# Altium schematic sheet Sheet1.SchDoc
size A4
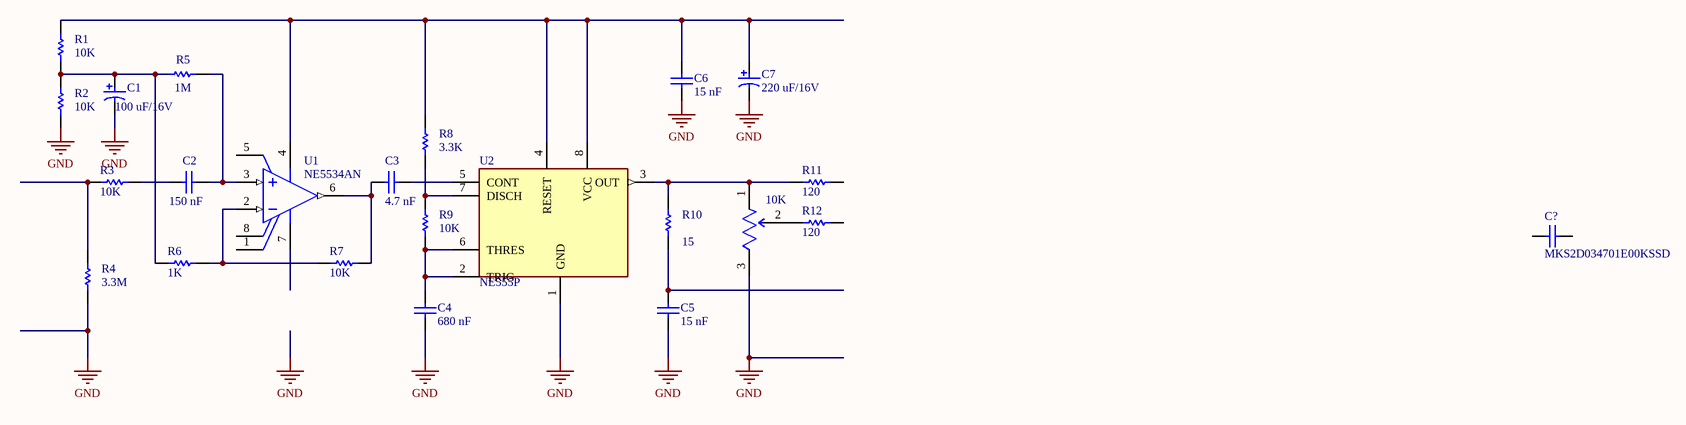
[diagram p0: Sheet1.SchDoc]

## Parts
10K  3296W-1-103RLF  [FP-3296W-MFG]  (value not drawn)
C1  100 uF/16V  [PNSC-ECA-1VM221-2]
C2  150 nF  [WIMA-MKS2D034701E00]
C3  4.7 nF  [WIMA-MKS2D034701E00]
C4  680 nF  [WIMA-MKS2D034701E00]
C5  15 nF  [WIMA-MKS2D034701E00]
C6  15 nF  [WIMA-MKS2D034701E00]
C7  220 uF/16V  [PNSC-ECA-1VM221-2]
C?  MKS2D034701E00KSSD  [WIMA-MKS2D034701E00]
R1  10K  [RESA60-630X240]
R2  10K  [RESA60-630X240]
R3  10K  [RESA60-630X240]
R4  3.3M  [RESA60-630X240]
R5  1M  [RESA60-630X240]
R6  1K  [RESA60-630X240]
R7  10K  [RESA60-630X240]
R8  3.3K  [RESA60-630X240]
R9  10K  [RESA60-630X240]
R10  15  [RESA60-630X240]
R11  120  [RESA60-630X240]
R12  120  [RESA60-630X240]
U1  NE5534AN  [ONSC-PDIP-8-626-05_M]
U2  NE555P  [FP-D0008A-MFG]

## Nets
GND: 10K.3(CW) C1.2 C4.1 C5.1 C6.1 C7.2 R2.1 R4.1 U2.1(GND)
Net10K_1: 10K.1(CCW) R10.2 R11.1 U2.3(OUT)
Net10K_2: 10K.2(WIPER) R12.1
NetC1_1: C1.1 R1.1 R2.2 R5.1 R6.1
NetC2_1: C2.1 R3.2
NetC2_2: C2.2 R5.2 U1.3(IN+)
NetC3_1: C3.1 R7.2 U1.6(OUT)
NetC3_2: C3.2 U2.5(CONT)
NetC4_2: C4.2 R9.1 U2.2(TRIG) U2.6(THRES)
NetC5_2: C5.2 R10.1
NetC6_2: C6.2 C7.1 R1.2 R8.2 U1.4(V-) U2.4(RESET) U2.8(VCC)
NetR3_1: R3.1 R4.2
NetR6_2: R6.2 R7.1 U1.2(IN-)
NetR8_1: R8.1 R9.2 U2.7(DISCH)

Not connected (* = marked no-connect by the designer): C? 1 2; R11 2; R12 2; U1 1(BALANCE) 5(COMPENSATION) 7(V+) 8(BALANCE/COMPENSATION)

## Library data of the parts
10K = CMP-07234-000024-1: TRIMMER 10K OHM 0.5W PC PIN TOP; Resistance: 10kR; Temperature Coefficient: 100ppm/°C; Power Rating: 500mW; Tolerance: 10%; Number of Turns: 25; Width: 0.19inch; Termination: Pin; Radiation Hardening: No; Contact Plating: Tin; Composition: Cermet; Length: 9.53mm; Height: 0.395inch; Depth: 4.83mm; REACH SVHC: No SVHC; Weight: 0.03oz; Min Operating Temperature: -55°C; Military Standard: Not; Max Operating Temperature: 125°C; Packaging: Tape and Reel; Package Quantity: 1; Taper: Linear; Max Power Dissipation: 500mW; Mount: Through Hole
C1 = CMP-2000-05311-1: Aluminum Electrolytic Capacitor, 100 uF, +/- 20%, 16 V, -40 to 85 degC, 2-Pin THD, RoHS, Bulk; Manufacturer: Panasonic; Lifetime@Temperature: 2000Hrs@85degC; Rated Voltage: 35V; Ripple Current: 350mA; Type: Radial; Capacitance: 220µF; Package Reference: ECA-1VM221; Series: M; Operating Temp Range: -40to+85degC; Package Description: 2-Pin Axial Lead, Dia 8 mm, Body Length 12.5 mm; Datasheet Version: Mar-06; Datasheet URL: https://datasheet.ciiva.com/26341/441851-da-01-en-elko-eca1vm221-m-r-220myf-35v-85c-26341906.pdf; Operating Temp-Max: 85degC; Case Size/Dimension: Ø8x11.5mm; Manufacturer URL: http://www.panasonic.com/
C2 = CMP-2000-06717-1: Metallized Polyester (PET) Capacitor, 150 nF, +/- 10%, 310 V AC, -55 to 100 degC, 2-Pin THD, RoHS, Bulk; Manufacturer: Wima; SVHC: NoSVHC(15-Jun-2015); Capacitor Dielectric Type: PET(Polyester); Voltage Rating: 100V; Capacitance: 0.47µF; Capacitor Terminals: RadialLeaded; Product Range: MKS2Series; Package Description: 2-Pin Through Hole Device, Body 7.2 x 4.5 mm, Pitch 5 mm; Mounting Technology: ThroughHole; Package Reference: MKS2D034701E00; Packaging: Each; Automotive Qualification Standard: -; Datasheet Version: 04/2016; Manufacturer URL: http://www.wima.com/; Operating Temperature Max: 100°C; Datasheet URL: http://www.wima.com/EN/WIMA_MKS_2.pdf; Operating Temperature Min: -55°C; Capacitance Tolerance: ±10%; Lead Spacing: 5mm; Capacitor Case Style: -
C3 = CMP-2000-06717-1: Metallized Polyester (PET) Capacitor, 4.7 nF, +/- 10%, 310 V AC, -55 to 100 degC, 2-Pin THD, RoHS, Bulk; Manufacturer: Wima; SVHC: NoSVHC(15-Jun-2015); Capacitor Dielectric Type: PET(Polyester); Voltage Rating: 100V; Capacitance: 0.47µF; Capacitor Terminals: RadialLeaded; Product Range: MKS2Series; Package Description: 2-Pin Through Hole Device, Body 7.2 x 4.5 mm, Pitch 5 mm; Mounting Technology: ThroughHole; Package Reference: MKS2D034701E00; Packaging: Each; Automotive Qualification Standard: -; Datasheet Version: 04/2016; Manufacturer URL: http://www.wima.com/; Operating Temperature Max: 100°C; Datasheet URL: http://www.wima.com/EN/WIMA_MKS_2.pdf; Operating Temperature Min: -55°C; Capacitance Tolerance: ±10%; Lead Spacing: 5mm; Capacitor Case Style: -
C4 = CMP-2000-06717-1: Metallized Polyester (PET) Capacitor, 680 nF, +/- 10%, 250V DC, -55 to 100 degC, 2-Pin THD, RoHS, Bulk; Manufacturer: Wima; SVHC: NoSVHC(15-Jun-2015); Capacitor Dielectric Type: PET(Polyester); Voltage Rating: 100V; Capacitance: 0.47µF; Capacitor Terminals: RadialLeaded; Product Range: MKS2Series; Package Description: 2-Pin Through Hole Device, Body 7.2 x 4.5 mm, Pitch 5 mm; Mounting Technology: ThroughHole; Package Reference: MKS2D034701E00; Packaging: Each; Automotive Qualification Standard: -; Datasheet Version: 04/2016; Manufacturer URL: http://www.wima.com/; Operating Temperature Max: 100°C; Datasheet URL: http://www.wima.com/EN/WIMA_MKS_2.pdf; Operating Temperature Min: -55°C; Capacitance Tolerance: ±10%; Lead Spacing: 5mm; Capacitor Case Style: -
C5 C6 = CMP-2000-06717-1: Metallized Polyester (PET) Capacitor, 15 nF, +/- 10%, 275 V AC, -55 to 100 degC, 2-Pin THD, RoHS, Bulk; Manufacturer: Wima; SVHC: NoSVHC(15-Jun-2015); Capacitor Dielectric Type: PET(Polyester); Voltage Rating: 100V; Capacitance: 0.47µF; Capacitor Terminals: RadialLeaded; Product Range: MKS2Series; Package Description: 2-Pin Through Hole Device, Body 7.2 x 4.5 mm, Pitch 5 mm; Mounting Technology: ThroughHole; Package Reference: MKS2D034701E00; Packaging: Each; Automotive Qualification Standard: -; Datasheet Version: 04/2016; Manufacturer URL: http://www.wima.com/; Operating Temperature Max: 100°C; Datasheet URL: http://www.wima.com/EN/WIMA_MKS_2.pdf; Operating Temperature Min: -55°C; Capacitance Tolerance: ±10%; Lead Spacing: 5mm; Capacitor Case Style: -
C7 = CMP-2000-05311-1: Aluminum Electrolytic Capacitor, 220 uF, +/- 20%, 16 V, -40 to 85 degC, 2-Pin THD, RoHS, Bulk; Manufacturer: Panasonic; Lifetime@Temperature: 2000Hrs@85degC; Rated Voltage: 35V; Ripple Current: 350mA; Type: Radial; Capacitance: 220µF; Package Reference: ECA-1VM221; Series: M; Operating Temp Range: -40to+85degC; Package Description: 2-Pin Axial Lead, Dia 8 mm, Body Length 12.5 mm; Datasheet Version: Mar-06; Datasheet URL: https://datasheet.ciiva.com/26341/441851-da-01-en-elko-eca1vm221-m-r-220myf-35v-85c-26341906.pdf; Operating Temp-Max: 85degC; Case Size/Dimension: Ø8x11.5mm; Manufacturer URL: http://www.panasonic.com/
C? = CMP-2000-06717-1: Metallized Polyester (PET) Capacitor, 0.47 uF, +/- 10%, 100 V DC, 63 V AC, -55 to 100 degC, 2-Pin THD, RoHS, Bulk; Manufacturer: Wima; SVHC: NoSVHC(15-Jun-2015); Capacitor Dielectric Type: PET(Polyester); Voltage Rating: 100V; Capacitance: 0.47µF; Capacitor Terminals: RadialLeaded; Product Range: MKS2Series; Package Description: 2-Pin Through Hole Device, Body 7.2 x 4.5 mm, Pitch 5 mm; Mounting Technology: ThroughHole; Package Reference: MKS2D034701E00; Packaging: Each; Automotive Qualification Standard: -; Datasheet Version: 04/2016; Manufacturer URL: http://www.wima.com/; Operating Temperature Max: 100°C; Datasheet URL: http://www.wima.com/EN/WIMA_MKS_2.pdf; Operating Temperature Min: -55°C; Capacitance Tolerance: ±10%; Lead Spacing: 5mm; Capacitor Case Style: -
R1 R2 R7 R9 = CMP-1659-00074-2: Axial Resistor, 10 KOhm, +/- 1%, 0.25 W, -55 to 155 degC, 2-Pin THD, RoHS, Bulk; Manufacturer: Yageo; Temperature Coefficient: 100ppm\/degreesC; Voltage Rating: 250V; Voltage Rating (DC): 200V; Resistance: 10KOhm; Max Power Dissipation: 250mW; Datasheet URL: http://www.yageo.com/documents/recent/Yageo%20LR_MFR_2013.pdf; Packaging: Bulk; RoHSCompliant: True; Mount: ThroughHole; Package Reference: MFR-25; Termination: Axial; Composition: MetalFilm; Number of Terminations: 2; Package Quantity: 200; Mounting Technology: ThroughHole; Length: 0.248inch; Max Operating Temperature: 155degC; Min Operating Temperature: -55degC; Datasheet Version: 04/2013; Lead Free: LeadFree; Manufacturer URL: http://www.yageo.com/; Tolerance: 1%; Power Rating: 250mW; Package Description: 2-Pin Axial Lead, Dia 2.4 mm, Body Length 6.3 mm; Military Standard: Not; Case\/Package: Axial
R3 = CMP-1659-00074-2: Axial Resistor, 10KOhm, +/- 5%, 0.25 W, -55 to 155 degC, 2-Pin THD, RoHS, Bulk; Manufacturer: Yageo; Temperature Coefficient: 100ppm\/degreesC; Voltage Rating: 250V; Voltage Rating (DC): 200V; Max Power Dissipation: 250mW; Tolerance: 1%; Datasheet URL: http://www.yageo.com/documents/recent/Yageo%20LR_MFR_2013.pdf; Packaging: Bulk; RoHSCompliant: True; Mount: ThroughHole; Package Reference: MFR-25; Termination: Axial; Composition: MetalFilm; Number of Terminations: 2; Resistance: 10KOhm; Package Quantity: 200; Mounting Technology: ThroughHole; Length: 0.248inch; Max Operating Temperature: 155degC; Min Operating Temperature: -55degC; Datasheet Version: 04/2013; Lead Free: LeadFree; Manufacturer URL: http://www.yageo.com/; Power Rating: 250mW; Package Description: 2-Pin Axial Lead, Dia 2.4 mm, Body Length 6.3 mm; Military Standard: Not; Case\/Package: Axial
R4 = CMP-1659-00074-2: Axial Resistor, 3.3 MOhm, +/- 5%, 0.25 W, -55 to 155 degC, 2-Pin THD, RoHS, Bulk; Manufacturer: Yageo; Temperature Coefficient: 100ppm\/degreesC; Voltage Rating: 250V; Voltage Rating (DC): 200V; Resistance: 10KOhm; Max Power Dissipation: 250mW; Tolerance: 1%; Datasheet URL: http://www.yageo.com/documents/recent/Yageo%20LR_MFR_2013.pdf; Packaging: Bulk; RoHSCompliant: True; Mount: ThroughHole; Package Reference: MFR-25; Termination: Axial; Composition: MetalFilm; Number of Terminations: 2; Package Quantity: 200; Mounting Technology: ThroughHole; Length: 0.248inch; Max Operating Temperature: 155degC; Min Operating Temperature: -55degC; Datasheet Version: 04/2013; Lead Free: LeadFree; Manufacturer URL: http://www.yageo.com/; Power Rating: 250mW; Package Description: 2-Pin Axial Lead, Dia 2.4 mm, Body Length 6.3 mm; Military Standard: Not; Case\/Package: Axial
R5 = CMP-1659-00074-2: Axial Resistor, 1 MOhm, +/- 1%, 0.25 W, -55 to 155 degC, 2-Pin THD, RoHS, Bulk; Manufacturer: Yageo; Temperature Coefficient: 100ppm\/degreesC; Voltage Rating: 250V; Voltage Rating (DC): 200V; Resistance: 10KOhm; Max Power Dissipation: 250mW; Datasheet URL: http://www.yageo.com/documents/recent/Yageo%20LR_MFR_2013.pdf; Packaging: Bulk; RoHSCompliant: True; Mount: ThroughHole; Package Reference: MFR-25; Termination: Axial; Composition: MetalFilm; Number of Terminations: 2; Package Quantity: 200; Mounting Technology: ThroughHole; Length: 0.248inch; Max Operating Temperature: 155degC; Min Operating Temperature: -55degC; Datasheet Version: 04/2013; Lead Free: LeadFree; Manufacturer URL: http://www.yageo.com/; Tolerance: 1%; Power Rating: 250mW; Package Description: 2-Pin Axial Lead, Dia 2.4 mm, Body Length 6.3 mm; Military Standard: Not; Case\/Package: Axial
R6 = CMP-1659-00074-2: Axial Resistor, 1 KOhm, +/- 1%, 0.25 W, -55 to 155 degC, 2-Pin THD, RoHS, Bulk; Manufacturer: Yageo; Temperature Coefficient: 100ppm\/degreesC; Voltage Rating: 250V; Voltage Rating (DC): 200V; Resistance: 10KOhm; Max Power Dissipation: 250mW; Datasheet URL: http://www.yageo.com/documents/recent/Yageo%20LR_MFR_2013.pdf; Packaging: Bulk; RoHSCompliant: True; Mount: ThroughHole; Package Reference: MFR-25; Termination: Axial; Composition: MetalFilm; Number of Terminations: 2; Package Quantity: 200; Mounting Technology: ThroughHole; Length: 0.248inch; Max Operating Temperature: 155degC; Min Operating Temperature: -55degC; Datasheet Version: 04/2013; Lead Free: LeadFree; Manufacturer URL: http://www.yageo.com/; Tolerance: 1%; Power Rating: 250mW; Package Description: 2-Pin Axial Lead, Dia 2.4 mm, Body Length 6.3 mm; Military Standard: Not; Case\/Package: Axial
R8 = CMP-1659-00074-2: Axial Resistor, 3.3 KOhm, +/- 1%, 0.25 W, -55 to 155 degC, 2-Pin THD, RoHS, Bulk; Manufacturer: Yageo; Temperature Coefficient: 100ppm\/degreesC; Voltage Rating: 250V; Voltage Rating (DC): 200V; Resistance: 10KOhm; Max Power Dissipation: 250mW; Datasheet URL: http://www.yageo.com/documents/recent/Yageo%20LR_MFR_2013.pdf; Packaging: Bulk; RoHSCompliant: True; Mount: ThroughHole; Package Reference: MFR-25; Termination: Axial; Composition: MetalFilm; Number of Terminations: 2; Package Quantity: 200; Mounting Technology: ThroughHole; Length: 0.248inch; Max Operating Temperature: 155degC; Min Operating Temperature: -55degC; Datasheet Version: 04/2013; Lead Free: LeadFree; Manufacturer URL: http://www.yageo.com/; Tolerance: 1%; Power Rating: 250mW; Package Description: 2-Pin Axial Lead, Dia 2.4 mm, Body Length 6.3 mm; Military Standard: Not; Case\/Package: Axial
R10 = CMP-1659-00074-2: Axial Resistor, 15 Ohm, +/- 1%, 0.25 W, -55 to 155 degC, 2-Pin THD, RoHS, Bulk; Manufacturer: Yageo; Temperature Coefficient: 100ppm\/degreesC; Voltage Rating: 250V; Voltage Rating (DC): 200V; Resistance: 10KOhm; Max Power Dissipation: 250mW; Datasheet URL: http://www.yageo.com/documents/recent/Yageo%20LR_MFR_2013.pdf; Packaging: Bulk; RoHSCompliant: True; Mount: ThroughHole; Package Reference: MFR-25; Termination: Axial; Composition: MetalFilm; Number of Terminations: 2; Package Quantity: 200; Mounting Technology: ThroughHole; Length: 0.248inch; Max Operating Temperature: 155degC; Min Operating Temperature: -55degC; Datasheet Version: 04/2013; Lead Free: LeadFree; Manufacturer URL: http://www.yageo.com/; Tolerance: 1%; Power Rating: 250mW; Package Description: 2-Pin Axial Lead, Dia 2.4 mm, Body Length 6.3 mm; Military Standard: Not; Case\/Package: Axial
R11 R12 = CMP-1659-00074-2: Axial Resistor, 120 Ohm, +/- 1%, 0.25 W, -55 to 155 degC, 2-Pin THD, RoHS, Bulk; Manufacturer: Yageo; Temperature Coefficient: 100ppm\/degreesC; Voltage Rating: 250V; Voltage Rating (DC): 200V; Resistance: 10KOhm; Max Power Dissipation: 250mW; Datasheet URL: http://www.yageo.com/documents/recent/Yageo%20LR_MFR_2013.pdf; Packaging: Bulk; RoHSCompliant: True; Mount: ThroughHole; Package Reference: MFR-25; Termination: Axial; Composition: MetalFilm; Number of Terminations: 2; Package Quantity: 200; Mounting Technology: ThroughHole; Length: 0.248inch; Max Operating Temperature: 155degC; Min Operating Temperature: -55degC; Datasheet Version: 04/2013; Lead Free: LeadFree; Manufacturer URL: http://www.yageo.com/; Tolerance: 1%; Power Rating: 250mW; Package Description: 2-Pin Axial Lead, Dia 2.4 mm, Body Length 6.3 mm; Military Standard: Not; Case\/Package: Axial
U1 = CMP-1310-00119-1: Single Low Noise Operational Amplifier, 6 to 40 V, 0 to 70 degC, 8-Pin PDIP, Tube; Manufacturer: On Semiconductor; VCC Min (V): 6; GBW Typ (MHz): 10; VCC Max (V): 40; ComponentLink3URL: http://www.onsemi.com/pub_link/Collateral/LM211-D.PDF; ComponentLink3Description: Package Specification; PackageDescription: 8-Pin Plastic Dual-In Line Package, Body 9.52 x 6.605 mm, Pitch 2.54 mm; ComponentLink1Description: Manufacturer URL; Mounting Technology: Through Hole; ComponentLink1URL: http://www.onsemi.com/; DatasheetVersion: Rev. 3; RoHS: FALSE; PackageReference: PDIP-8-626-05; ComponentLink2Description: Datasheet; PartNumber: NE5534AN; ComponentLink2URL: http://www.onsemi.cn/pub_link/Collateral/NE5534-D.PDF; PackageVersion: Rev. M, 04/2010; Packing: Tube
U2 = CMP-04858-000018-1: IC OSC SGL TIMER 100KHZ 8-SOIC; Nominal Supply Current: 4mA; Min Supply Voltage: 4.5V; Max Supply Voltage: 18V; High Level Output Current: -200mA; Quiescent Current: 12mA; Operating Supply Current: 10mA; Number of Timers/Counters: 1; Low Level Output Current: 200mA; Weight: 0.002677oz; Frequency: 100kHz; Lead Free: Lead Free; Supply Current: 4mA; RoHS Compliant: Yes; Package Quantity: 2500; Min Operating Temperature: -55°C; Series: -; Radiation Hardening: No; Contact Plating: Gold; Packaging: Tape and Reel; Case/Package: SOIC; Number of Pins: 8; Mount: Surface Mount; Max Operating Temperature: 125°C; REACH SVHC: No SVHC